# EAGLE design Button Mount (EAGLE 9.6.2)
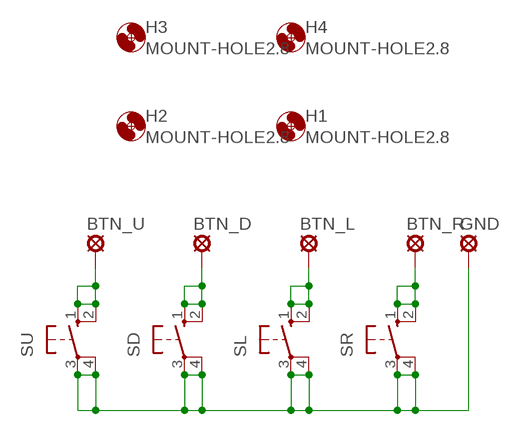
[diagram p0: schematic, sheet 1]

## Parts
BTN_D  LSP10  [LSP10]
BTN_L  LSP10  [LSP10]
BTN_R  LSP10  [LSP10]
BTN_U  LSP10  [LSP10]
GND  LSP10  [LSP10]
H1  MOUNT-HOLE2.8  [2,8]
H2  MOUNT-HOLE2.8  [2,8]
H3  MOUNT-HOLE2.8  [2,8]
H4  MOUNT-HOLE2.8  [2,8]
SD  10-XX  [B3F-10XX]
SL  10-XX  [B3F-10XX]
SR  10-XX  [B3F-10XX]
SU  10-XX  [B3F-10XX]

## Nets
N$1: BTN_U.MP SU.1(S) SU.2(S1)
N$3: BTN_D.MP SD.1(S) SD.2(S1)
N$4: GND.MP SD.3(P) SD.4(P1) SL.3(P) SL.4(P1) SR.3(P) SR.4(P1) SU.3(P) SU.4(P1)
N$6: BTN_L.MP SL.1(S) SL.2(S1)
N$7: BTN_R.MP SR.1(S) SR.2(S1)

## Library data of the parts
BTN_D BTN_L BTN_R BTN_U GND = solpad:LSP10: SOLDER PAD drill 1.0 mm, distributor Buerklin, 12H555
H1-H4 = holes:MOUNT-HOLE: MOUNTING HOLE with drill center marker
SD SL SR SU = switch-omron:10-XX: OMRON SWITCH; MPN: B3F-1000; OC_FARNELL: 176432; OC_NEWARK: 36M3542

## Board
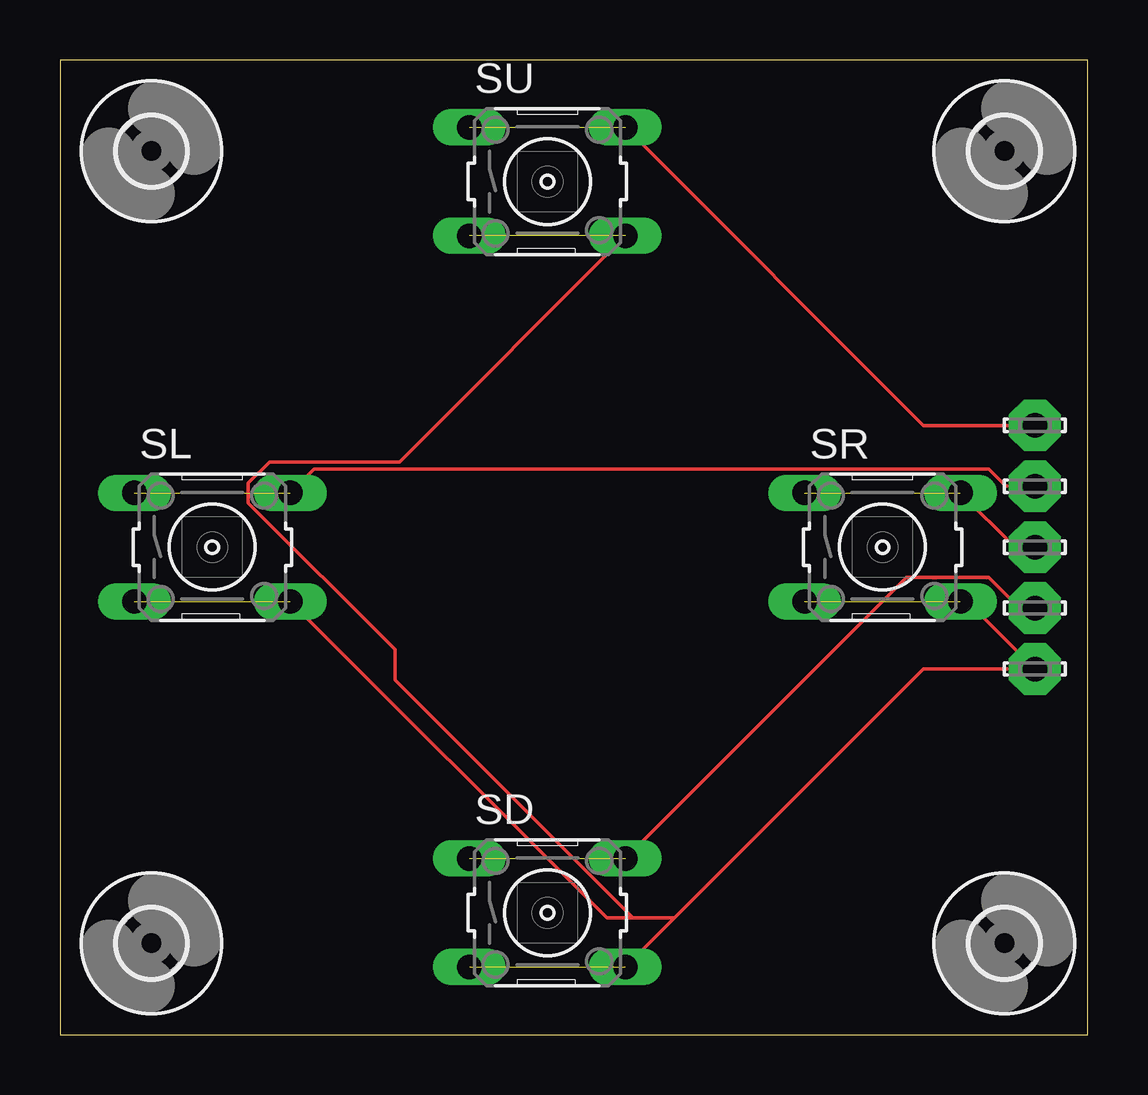
[diagram p1: board, top side]

Size 42.85 x 40.63 mm. Coordinates in mm from the lower left corner, seen from the top.
Outline: 0,0 42.85,0 42.85,40.63 0,40.63 0,0
Copper layers (1*16): Top 0.035mm / dielectric 1.5mm / Bottom 0.035mm
Design rules "default": minimum track width 6mil, minimum drill 0.35mm, track to track 6mil, track to pad 6mil, pad to pad 6mil, via to via 6mil, smd to smd 6mil, copper to edge 40mil, drill to drill 6mil, minimum pad ring 10mil, minimum via ring 8mil, stop-mask expansion 4mil, vias tented up to drill 0mil, thermal gap 10mil

### Footprints (pad centres in the part's own frame; a part is rotated, then mirrored left to right if it is on the bottom)
LSP10 = drill 1.016 pad 2.159 octagon: MP 0,0
2,8 = hole 2.8: 0,0
B3F-10XX = drill 1.016 long: 1 -3.251,2.261; 2 3.251,2.261; 3 -3.251,-2.261; 4 3.251,-2.261

### Placement (x,y rotation side)
BTN_D  40.64,17.78 0 top
BTN_L  40.64,22.86 0 top
BTN_R  40.64,20.32 0 top
BTN_U  40.64,25.4 0 top
GND  40.64,15.24 0 top
H1  39.37,3.81 0 top
H2  3.81,36.83 0 top
H3  39.37,36.83 0 top
H4  3.81,3.81 0 top
SD  20.32,5.08 0 top
SL  6.35,20.32 0 top
SR  34.29,20.32 0 top
SU  20.32,35.56 0 top

### Tracks (layer width: path | path; a pad name or v marks a point on that pad's centre or on a via)
N$1  (1 unrouted)
  Top 0.152: BTN_U.MP 35.99,25.4 SU.2
N$3  (1 unrouted)
  Top 0.152: BTN_D.MP 39.98,17.78 38.71,19.05 35.28,19.05 SD.2
N$4  (4 unrouted)
  Top 0.152: SR.4 37.82,18.06 GND.MP 35.99,15.24 25.62,4.86 | SD.4 25.62,4.86 | SL.4 22.8,4.86 23.89,4.86 | 25.62,4.86 25.4,4.86 23.89,4.86 | SU.4 14.15,23.88 8.73,23.88 7.85,22.99 7.85,22.17 13.97,16.05 13.97,14.78 23.89,4.86
N$6  (1 unrouted)
  Top 0.152: BTN_L.MP 39.42,22.86 38.71,23.57 10.59,23.57 SL.2
N$7  (1 unrouted)
  Top 0.152: SR.2 39.8,20.32 BTN_R.MP